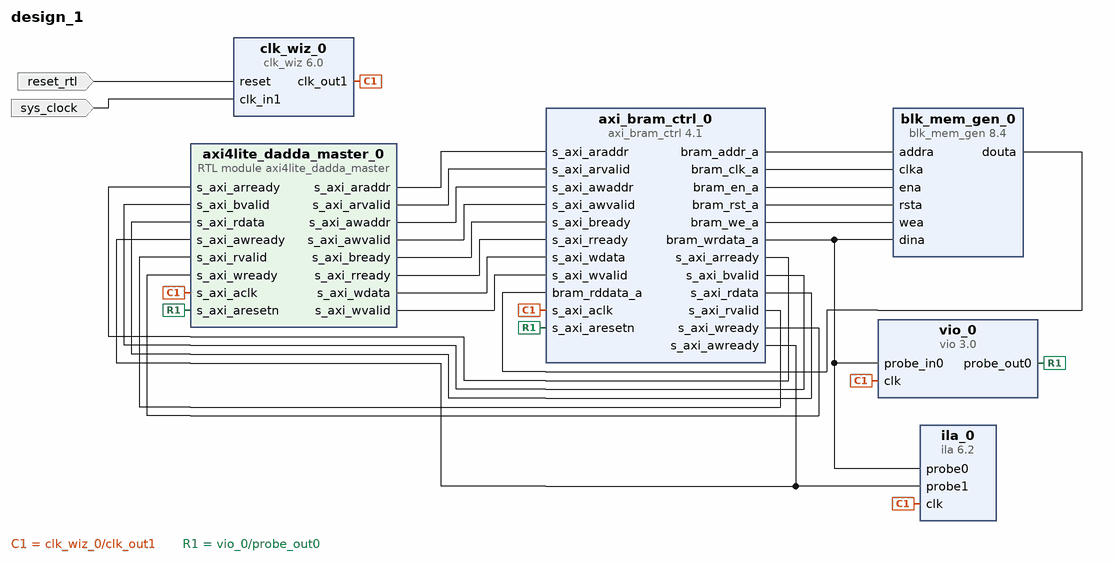
[diagram p0: block diagram of the top level]
# Vivado block design design_1, xc7z020clg400-1, Vivado 2023.2
create_bd_design design_1

create_bd_port -dir I -type clk sys_clock
set_property -dict {CONFIG.FREQ_HZ 125000000 CONFIG.PHASE 0.000} [get_bd_ports sys_clock]
create_bd_port -dir I -type rst reset_rtl
set_property -dict {CONFIG.POLARITY ACTIVE_HIGH} [get_bd_ports reset_rtl]

create_bd_cell -type module -reference axi4lite_dadda_master axi4lite_dadda_master_0
create_bd_cell -type ip -vlnv xilinx.com:ip:vio:3.0 vio_0
create_bd_cell -type ip -vlnv xilinx.com:ip:ila:6.2 ila_0
set_property -dict [list \
  CONFIG.C_ENABLE_ILA_AXI_MON false \
  CONFIG.C_MONITOR_TYPE Native \
  CONFIG.C_NUM_OF_PROBES 2 \
  CONFIG.C_PROBE0_WIDTH 32 \
] [get_bd_cells ila_0]
create_bd_cell -type ip -vlnv xilinx.com:ip:axi_bram_ctrl:4.1 axi_bram_ctrl_0
set_property -dict {CONFIG.PROTOCOL AXI4LITE CONFIG.SINGLE_PORT_BRAM 1} [get_bd_cells axi_bram_ctrl_0]
create_bd_cell -type ip -vlnv xilinx.com:ip:blk_mem_gen:8.4 blk_mem_gen_0
set_property -dict [list \
  CONFIG.Coe_File ../../../../../../axilitedata.coe \
  CONFIG.EN_SAFETY_CKT true \
  CONFIG.Enable_32bit_Address true \
  CONFIG.Load_Init_File true \
  CONFIG.Register_PortA_Output_of_Memory_Primitives false \
  CONFIG.Use_RSTA_Pin true \
  CONFIG.Write_Depth_A 32768 \
  CONFIG.use_bram_block Stand_Alone \
] [get_bd_cells blk_mem_gen_0]
create_bd_cell -type ip -vlnv xilinx.com:ip:clk_wiz:6.0 clk_wiz_0
set_property -dict [list \
  CONFIG.CLKIN1_JITTER_PS 80.0 \
  CONFIG.CLKOUT1_JITTER 124.615 \
  CONFIG.CLKOUT1_PHASE_ERROR 96.948 \
  CONFIG.CLK_IN1_BOARD_INTERFACE sys_clock \
  CONFIG.MMCM_CLKFBOUT_MULT_F 8.000 \
  CONFIG.MMCM_CLKIN1_PERIOD 8.000 \
  CONFIG.USE_BOARD_FLOW true \
] [get_bd_cells clk_wiz_0]

# ---- connections ----

connect_bd_net [get_bd_pins axi4lite_dadda_master_0/s_axi_araddr] [get_bd_pins axi_bram_ctrl_0/s_axi_araddr]
connect_bd_net [get_bd_pins axi4lite_dadda_master_0/s_axi_arvalid] [get_bd_pins axi_bram_ctrl_0/s_axi_arvalid]
connect_bd_net [get_bd_pins axi4lite_dadda_master_0/s_axi_awaddr] [get_bd_pins axi_bram_ctrl_0/s_axi_awaddr]
connect_bd_net [get_bd_pins axi4lite_dadda_master_0/s_axi_awvalid] [get_bd_pins axi_bram_ctrl_0/s_axi_awvalid]
connect_bd_net [get_bd_pins axi4lite_dadda_master_0/s_axi_bready] [get_bd_pins axi_bram_ctrl_0/s_axi_bready]
connect_bd_net [get_bd_pins axi4lite_dadda_master_0/s_axi_rready] [get_bd_pins axi_bram_ctrl_0/s_axi_rready]
connect_bd_net [get_bd_pins axi4lite_dadda_master_0/s_axi_wdata] [get_bd_pins axi_bram_ctrl_0/s_axi_wdata]
connect_bd_net [get_bd_pins axi4lite_dadda_master_0/s_axi_wvalid] [get_bd_pins axi_bram_ctrl_0/s_axi_wvalid]
connect_bd_net [get_bd_pins axi_bram_ctrl_0/bram_addr_a] [get_bd_pins blk_mem_gen_0/addra]
connect_bd_net [get_bd_pins axi_bram_ctrl_0/bram_clk_a] [get_bd_pins blk_mem_gen_0/clka]
connect_bd_net [get_bd_pins axi_bram_ctrl_0/bram_en_a] [get_bd_pins blk_mem_gen_0/ena]
connect_bd_net [get_bd_pins axi_bram_ctrl_0/bram_rst_a] [get_bd_pins blk_mem_gen_0/rsta]
connect_bd_net [get_bd_pins axi_bram_ctrl_0/bram_we_a] [get_bd_pins blk_mem_gen_0/wea]
connect_bd_net [get_bd_pins axi_bram_ctrl_0/bram_wrdata_a] [get_bd_pins blk_mem_gen_0/dina] [get_bd_pins ila_0/probe0] [get_bd_pins vio_0/probe_in0]
connect_bd_net [get_bd_pins axi_bram_ctrl_0/s_axi_arready] [get_bd_pins axi4lite_dadda_master_0/s_axi_arready]
connect_bd_net [get_bd_pins axi_bram_ctrl_0/s_axi_awready] [get_bd_pins ila_0/probe1] [get_bd_pins axi4lite_dadda_master_0/s_axi_awready]
connect_bd_net [get_bd_pins axi_bram_ctrl_0/s_axi_bvalid] [get_bd_pins axi4lite_dadda_master_0/s_axi_bvalid]
connect_bd_net [get_bd_pins axi_bram_ctrl_0/s_axi_rdata] [get_bd_pins axi4lite_dadda_master_0/s_axi_rdata]
connect_bd_net [get_bd_pins axi_bram_ctrl_0/s_axi_rvalid] [get_bd_pins axi4lite_dadda_master_0/s_axi_rvalid]
connect_bd_net [get_bd_pins axi_bram_ctrl_0/s_axi_wready] [get_bd_pins axi4lite_dadda_master_0/s_axi_wready]
connect_bd_net [get_bd_pins blk_mem_gen_0/douta] [get_bd_pins axi_bram_ctrl_0/bram_rddata_a]
connect_bd_net [get_bd_pins clk_wiz_0/clk_out1] \
  [get_bd_pins axi_bram_ctrl_0/s_axi_aclk] [get_bd_pins ila_0/clk] [get_bd_pins vio_0/clk] \
  [get_bd_pins axi4lite_dadda_master_0/s_axi_aclk]
connect_bd_net [get_bd_ports reset_rtl] [get_bd_pins clk_wiz_0/reset]
connect_bd_net [get_bd_ports sys_clock] [get_bd_pins clk_wiz_0/clk_in1]
connect_bd_net [get_bd_pins vio_0/probe_out0] [get_bd_pins axi_bram_ctrl_0/s_axi_aresetn] [get_bd_pins axi4lite_dadda_master_0/s_axi_aresetn]

validate_bd_design
save_bd_design
